# EAGLE design DeskLight (EAGLE 9.4.0)
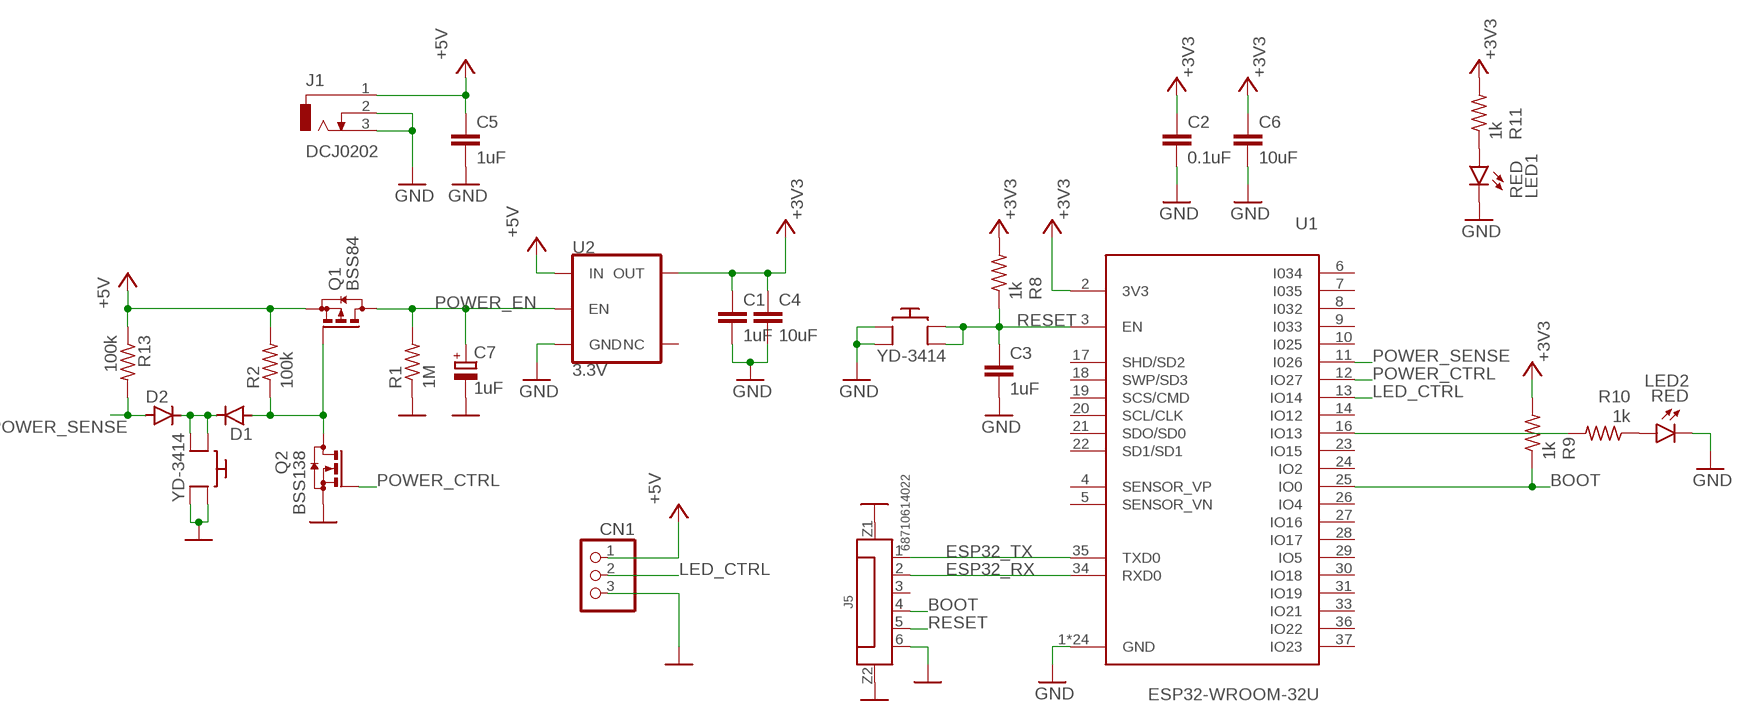
[diagram p0: schematic, sheet 1]

## Parts
C1  1uF  C-EUC0603  [C0603]
C2  0.1uF  C-EUC0603  [C0603]
C3  1uF  C-EUC0603  [C0603]
C4  10uF  C-EUC0805  [C0805]
C5  1uF  C-EUC0603  [C0603]
C6  10uF  C-EUC0805  [C0805]
C7  1uF  CPOL-EUCT3216  [CT3216]
CN1  JST_3PIN  [JSTPH3]
D1  D-SOD123  [SOD123]
D2  D-SOD123  [SOD123]
J1  DCJ0202  [DCJ0202]
J5  68710614022  6871XX14022_68710614022  [68710614022]
LED1  RED  LEDMICRO-SIDELED  [MICRO-SIDELED]
LED2  RED  LEDMICRO-SIDELED  [MICRO-SIDELED]
Q1  BSS84  [SOT23]
Q2  BSS138  BSS123  [SOT23]
R1  1M  R-US_R0603  [R0603]
R2  100k  R-US_R0603  [R0603]
R8  1k  R-US_R0603  [R0603]
R9  1k  R-US_R0603  [R0603]
R10  1k  R-US_R0603  [R0603]
R11  1k  R-US_R0603  [R0603]
R13  100k  R-US_R0603  [R0603]
U1  ESP32-WROOM-32U  [XCVR_ESP32-WROOM-32U]
U2  3.3V  V_REG_AP2112K-3.3V  [SOT23-5]
U$1  YD-3414  [YD-3414]
U$67  YD-3414  [YD-3414]

## Nets
+3V3: C1.1 C2.1 C4.1 C6.1 R8.2 R9.2 R11.2 U1.2(3V3) U2.5(OUT)
+5V: C5.1 CN1.1 J1.1 Q1.2(S) R2.2 R13.1 U2.1(IN)
BOOT: J5.4 R9.1 U1.25(IO0)
ESP32_RX: J5.2 U1.34(RXD0)
ESP32_TX: J5.1 U1.35(TXD0)
GND: C1.2 C2.2 C3.2 C4.2 C5.2 C6.2 C7.- CN1.3 J1.2 J1.3 J5.6 J5.Z1 J5.Z2 LED1.C LED2.C Q2.2(S) R1.1 U1.1(GND) U1.15(GND) U1.38(GND) U1.G.1(GND) U1.G.2(GND) U1.G.4(GND) U1.G.5(GND) U1.G.6(GND) U1.G.7(GND) U1.G.8(GND) U1.G.9(GND) U1.G.10(GND) U1.G.11(GND) U1.G.12(GND) U1.G.13(GND) U1.G.14(GND) U1.G.15(GND) U1.G.16(GND) U1.G.17(GND) U1.G.18(GND) U1.G.19(GND) U1.G.20(GND) U1.G.21(GND) U1.G.22(GND) U2.2(GND) U$1.P$3 U$1.P$4 U$67.P$3 U$67.P$4
LED_CTRL: CN1.2 U1.13(IO14)
N$1: D1.2(A) Q1.1(G) Q2.3(D) R2.1
N$2: R10.2 U1.16(IO13)
N$8: LED1.A R11.1
N$11: D1.1(C) D2.1(C) U$67.P$1 U$67.P$2
N$13: LED2.A R10.1
POWER_CTRL: Q2.1(G) U1.12(IO27)
POWER_EN: C7.+ Q1.3(D) R1.2 U2.3(EN)
POWER_SENSE: D2.2(A) R13.2 U1.11(I026)
RESET: C3.1 J5.5 R8.1 U1.3(EN) U$1.P$1 U$1.P$2
Unconnected: J5.3 U1.4(SENSOR_VP) U1.5(SENSOR_VN) U1.6(I034) U1.7(I035) U1.8(I032) U1.9(I033) U1.10(I025) U1.14(IO12) U1.17(SHD/SD2) U1.18(SWP/SD3) U1.19(SCS/CMD) U1.20(SCL/CLK) U1.21(SDO/SD0) U1.22(SD1/SD1) U1.23(IO15) U1.24(IO2) U1.26(IO4) U1.27(IO16) U1.28(IO17) U1.29(IO5) U1.30(IO18) U1.31(IO19) U1.33(IO21) U1.36(IO22) U1.37(IO23) U2.4(NC)

## Library data of the parts
C1-C6 = rcl:C-EU: CAPACITOR, European symbol; SPICEPREFIX: C
C7 = rcl:CPOL-EU: POLARIZED CAPACITOR, European symbol; SPICEPREFIX: C
CN1 = adafruit:JST_3PIN
D1 D2 = semicon-smd-ipc:D-: DIODE unfilled
J1 = con-jack:DCJ0202: DC POWER JACK Source: DCJ0202.pdf; OC_FARNELL: unknown; OC_NEWARK: unknown
J5 = WR-FPC:6871XX14022_68710614022: WR-FPC 0.50 mm SMT ZIF Horizontal Top Contact KIND PROPERTIES Pitch 0.5 mm MATERIAL PROPERTIES Insulator Material LCP Contact Material Phosphor Bronze Contact Plating 100 (µ") Tin over 50 (µ") Nickel Contact Type Stamped Solder Tabs Brass <https://www.we-online.com/catalog/media/o32866v209%20Family_WE-FPC_6871xx14022.jpg> Details see: https://www.we-online.com/catalog/en/FPC_0_5_SMT_ZIF_HORIZONTAL_TOP_CONTACT_6871XX14022/ Updated by Ella Wu 2020-08-26 2020(C) Wurth Elektronik; CONTACT-RESISTANCE: 20Ohm; DATASHEET-URL: https://www.we-online.com/catalog/datasheet/68710614022.pdf; IR: 0.5A; L: 9.4mm; PACKAGING: Tape and Reel; PART-NUMBER: 68710614022; PINS: 6; PITCH: 0.5mm; TYPE: Horizontal; WORKING-VOLTAGE: 50V(AC)
LED1 LED2 = led:LED: LED OSRAM: - CHIPLED LG R971, LG N971, LY N971, LG Q971, LY Q971, LO R971, LY R971 LH N974, LH R974 LS Q976, LO Q976, LY Q976 LO Q996 - Hyper CHIPLED LW Q18S LB Q993, LB Q99A, LB R99A - SideLED LS A670, LO A670, LY A670, LG A670, LP A670 LB A673, LV A673, LT A673, LW A673 LH A674 LY A675 LS A676, LA A676, LO A676, LY A676, LW A676 LS A679, LY A679, LG A679 - Hyper Micro SIDELED® LS Y876, LA Y876, LO Y876, LY Y876 LT Y87S - SmartLED LW L88C, LW L88S LB L89C, LB L89S, LG L890 LS L89K, LO L89K, LY L89K LS L896, LA L896, LO L896, LY L896 - TOPLED LS T670, LO T670, LY T670, LG T670, LP T670 LSG T670, LSP T670, LSY T670, LOP T670, LYG T670 LG T671, LOG T671, LSG T671 LB T673, LV T673, LT T673, LW T673 LH T674 LS T676, LA T676, LO T676, LY T676, LB T676, LH T676, LSB T676, LW T676 LB T67C, LV T67C, LT T67C, LS T67K, LO T67K, LY T67K, LW E67C LS E67B, LA E67B, LO E67B, LY E67B, LB E67C, LV E67C, LT E67C LW T67C LS T679, LY T679, LG T679 LS T770, LO T770, LY T770, LG T770, LP T770 LB T773, LV T773, LT T773, LW T773 LH T774 LS E675, LA E675, LY E675, LS T675 LS T776, LA T776, LO T776, LY T776, LB T776 LHGB T686 LT T68C, LB T68C - Hyper Mini TOPLED® LB M676 - Mini TOPLED Santana® LG M470 LS M47K, LO M47K, LY M47K Source: http://www.osram.convergy.de LUXEON: - LUMILED® LXK2-PW12-R00, LXK2-PW12-S00, LXK2-PW14-U00, LXK2-PW14-V00 LXK2-PM12-R00, LXK2-PM12-S00, LXK2-PM14-U00 LXK2-PE12-Q00, LXK2-PE12-R00, LXK2-PE12-S00, LXK2-PE14-T00, LXK2-PE14-U00 LXK2-PB12-K00, LXK2-PB12-L00, LXK2-PB12-M00, LXK2-PB14-N00, LXK2-PB14-P00, LXK2-PB14-Q00 LXK2-PR12-L00, LXK2-PR12-M00, LXK2-PR14-Q00, LXK2-PR14-R00 LXK2-PD12-Q00, LXK2-PD12-R00, LXK2-PD12-S00 LXK2-PH12-R00, LXK2-PH12-S00 LXK2-PL12-P00, LXK2-PL12-Q00, LXK2-PL12-R00 Source: www.luxeon.com KINGBRIGHT: KA-3528ASYC Source: www.kingbright.com
Q1 = transistor-small-signal:BSS84: P-CHANNEL MOS FET
Q2 = transistor-small-signal:BSS123: N-CHANNEL MOS FET
R1 R2 R8-R11 R13 = rcl:R-US_: RESISTOR, American symbol; SPICEPREFIX: R
U1 = ESP32-WROOM-32U:ESP32-WROOM-32U: Wi-Fi/BT BLE Module ESP32-D0WD SPI Flash UART U.FL Conn.; AVAILABILITY: Unavailable; DESCRIPTION: Bluetooth, WiFi 802.11b/g/n, Bluetooth v4.2 +EDR, Class 1, 2 and 3 Transceiver Module 2.4GHz ~ 2.5GHz Antenna Not Included, U.FL Surface Mount; MF: Espressif Systems; MP: ESP32-WROOM-32U; PACKAGE: Module Espressif Systems; PRICE: None
U2 = SparkFun-IC-Power:V_REG_AP2112: AP2112 - 600mA CMOS LDO Regulator w/ Enable The AP2112 is CMOS process low dropout linear regulator with enable function, the regulator delivers a guaranteed 600mA (min.) continuous load current. Features Output Voltage Accuracy: ±1.5% Output Current: 600mA (Min.) Foldback Short Current Protection: 50mA Enable Function to Turn ON/OFF VOUT Low Dropout Voltage (3.3V): 250mV (Typ.) @IOUT=600mA Excellent Load Regulation: 0.2%/A (Typ.) Excellent Line Regulation: 0.02%/V (Typ.) Low Quiescent Current: 55μA (Typ.) Low Standby Current: 0.01μA (Typ.) Low Output Noise: 50μVRMS PSRR: 100Hz -65dB, 1kHz -65dB OTSD Protection Stable with 1.0μF Flexible Cap: Ceramic, Tantalum and Aluminum Electrolytic Operation Temperature Range: -40°C to 85°C ESD: MM 400V, HBM 4000V; PROD_ID: VREG-12457
U$1 U$67 = YD-3414:YD-3414

## Board
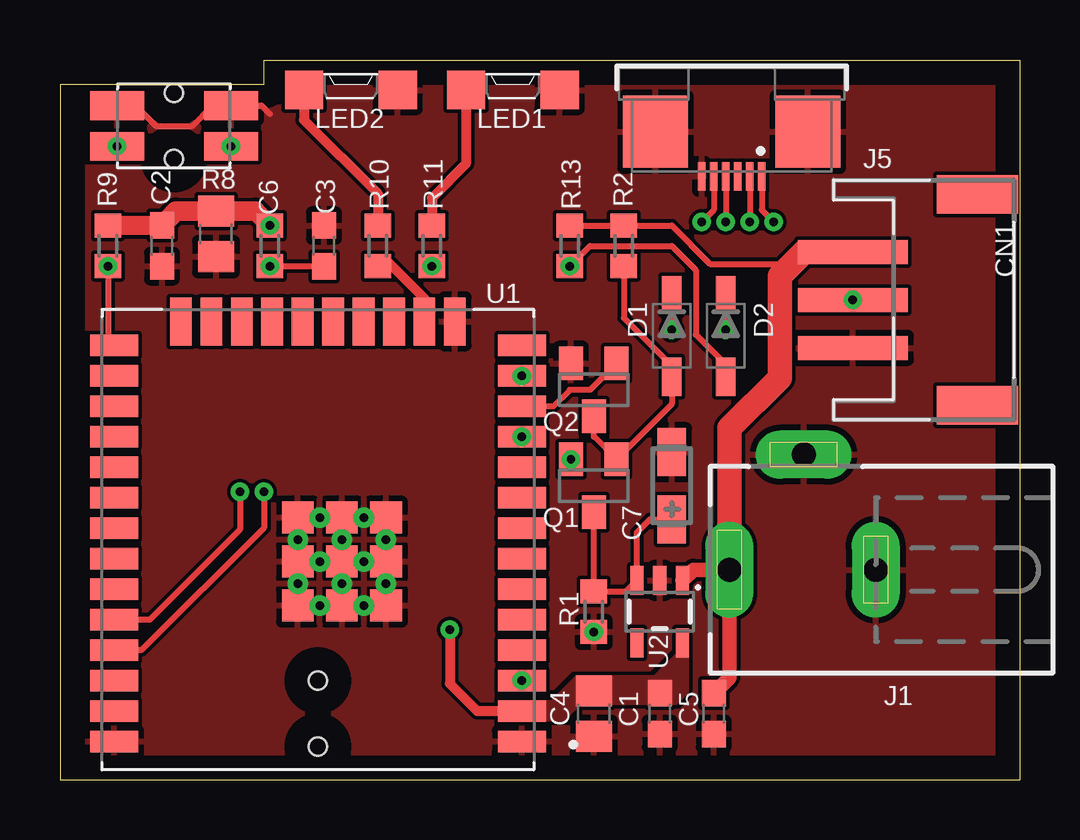
[diagram p1: board, top side]
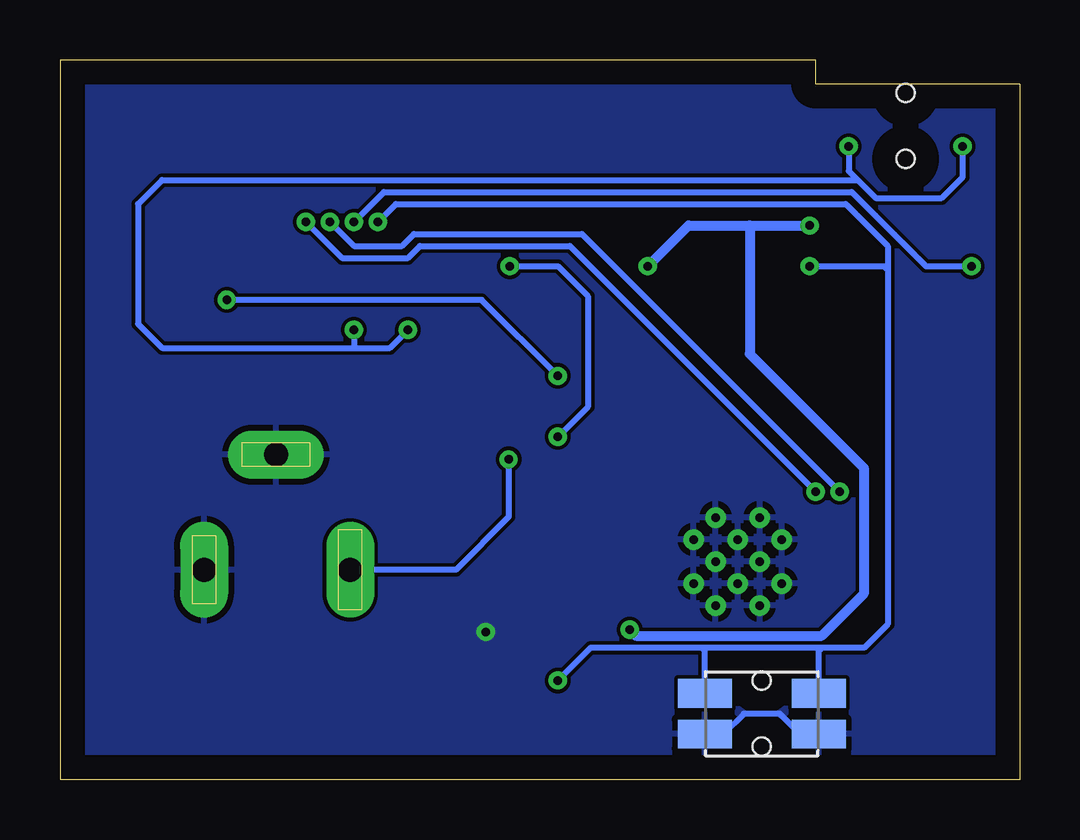
[diagram p2: board, bottom side, seen from below]

Size 40 x 30 mm. Coordinates in mm from the lower left corner, seen from the top.
Outline: 0,29 0,0 40,0 40,30 8.5,30 8.5,29 0,29
Copper layers (1*16): Top 0.035mm / dielectric 0.93mm / Bottom 0.035mm
Design rules "default *": minimum track width 6mil, minimum drill 0.35mm, track to track 6mil, track to pad 6mil, pad to pad 6mil, via to via 6mil, smd to smd 6mil, copper to edge 40mil, drill to drill 6mil, minimum pad ring 10mil, minimum via ring 8mil, stop-mask expansion 4mil, vias tented up to drill 0.35mm, thermal gap 10mil

### Footprints (pad centres in the part's own frame; a part is rotated, then mirrored left to right if it is on the bottom)
C0603 = smd 1.1 x 1: 1 -0.85,0; 2 0.85,0
C0805 = smd 1.3 x 1.5: 1 -0.95,0; 2 0.95,0
CT3216 = smd 2 x 1.2: + -1.4,0; - 1.4,0
JSTPH3 = smd 1 x 4.6: 1 -2,-2.7; 2 0,-2.7; 3 2,-2.7 | smd 1.6 x 3.4: NC1 -4.4,2.5; NC2 4.4,2.5
SOD123 = smd 1.6 x 0.8: 1 -1.7,0; 2 1.7,0
DCJ0202 = drill 1 pad 2 long: 1 0,3.1; 2 4.8,0; 3 0,-3
68710614022 = smd 0.3 x 1.2: 1 -1.25,2.35; 2 -0.75,2.35; 3 -0.25,2.35; 4 0.25,2.35; 5 0.75,2.35; 6 1.25,2.35 | smd 2.7 x 3: Z1 -3.18,0.49; Z2 3.18,0.49
MICRO-SIDELED = smd 1.6 x 1.6: A 0,1.95; C 0,-1.95
SOT23 = smd 1 x 1.4: 1 -0.95,-1.1; 2 0.95,-1.1; 3 0,1.1
R0603 = smd 1 x 1.1: 1 -0.85,0; 2 0.85,0
XCVR_ESP32-WROOM-32U = smd 2 x 0.9: 1 -8.5,8.41; 2 -8.5,7.14; 3 -8.5,5.87; 4 -8.5,4.6; 5 -8.5,3.33; 6 -8.5,2.06; 7 -8.5,0.79; 8 -8.5,-0.48; 9 -8.5,-1.75; 10 -8.5,-3.02; 11 -8.5,-4.29; 12 -8.5,-5.56; 13 -8.5,-6.83; 14 -8.5,-8.1; 25 8.5,-8.1; 26 8.5,-6.83; 27 8.5,-5.56; 28 8.5,-4.29; 29 8.5,-3.02; 30 8.5,-1.75; 31 8.5,-0.48; 32 8.5,0.79; 33 8.5,2.06; 34 8.5,3.33; 35 8.5,4.6; 36 8.5,5.87; 37 8.5,7.14; 38 8.5,8.41 | smd 0.9 x 2: 15 -5.715,-9.1; 16 -4.445,-9.1; 17 -3.175,-9.1; 18 -1.905,-9.1; 19 -0.635,-9.1; 20 0.635,-9.1; 21 1.905,-9.1; 22 3.175,-9.1; 23 4.445,-9.1; 24 5.715,-9.1 | smd 1.33 x 1.33: G.1 0.835,2.745; G.2 -1,2.745; G.4 -2.835,2.745; G.5 0.835,0.91; G.6 -1,0.91; G.7 -2.835,0.91; G.8 0.835,-0.925; G.9 -1,-0.925; G.10 -2.835,-0.925 | drill 0.35: G.11 -0.083,2.745; G.12 -1.917,2.745; G.13 0.835,1.827; G.14 -1,1.827; G.15 -2.835,1.827; G.16 -0.083,0.91; G.17 -1.917,0.91; G.18 0.835,-0.007; G.19 -1,-0.007; G.20 -2.835,-0.007; G.21 -0.083,-0.925; G.22 -1.917,-0.925
SOT23-5 = smd 0.55 x 1.2: 1 -0.95,-1.3; 2 0,-1.3; 3 0.95,-1.3; 4 0.95,1.3; 5 -0.95,1.3
YD-3414 = smd 2.25 x 1.2: P$1 -2.375,0.85; P$2 2.375,0.85; P$3 -2.375,-0.85; P$4 2.375,-0.85 | hole 0.75: 0,-1.375; 0,1.375

### Placement (x,y rotation side)
C1  25,2.75 270 top
C2  4.25,22.25 270 top
C3  11,22.25 90 top
C4  22.25,2.75 270 top
C5  27.25,2.75 270 top
C6  6.5,22.75 270 top
C7  25.5,12.25 90 top
CN1  35.75,20 270 top
D1  25.5,18.5 270 top
D2  27.75,18.5 270 top
J1  31,8.75 90 top
J5  28,27.5 180 top
LED1  18.88,28.75 90 top
LED2  12.12,28.75 90 top
Q1  22.25,12.25 180 top
Q2  22.25,16.25 180 top
R1  22.25,7 90 top
R2  23.5,22.25 90 top
R8  8.75,22.25 90 top
R9  2,22.25 90 top
R10  13.25,22.25 270 top
R11  15.5,22.25 270 top
R13  21.25,22.25 270 top
U1  10.75,10 180 top
U2  25,7 180 top
U$1  10.75,2.75 0 bottom
U$67  4.75,27.25 180 top

### Tracks (layer width: path | path; a pad name or v marks a point on that pad's centre or on a via)
+3V3  (via drill 0.35)
  Top 0.406: v16.25,6.25 16.25,4 17.39,2.86 U1.2
  Top 0.813: R9.2 2.02,23.12 C2.1 4.83,23.7 C6.1 8.15,23.7 R8.2
  Bottom 0.406: R11.2 13.8,23.1 11.25,23.1 | 11.25,23.1 R8.2 | 11.25,23.1 11.25,17.75 6.5,13 6.5,7.75 8.25,6 16,6 v16.25,6.25
  other vias: 15.5,21.4 8.75,23.1
  pour Top (no thermals): 18.33,3.23 20.48,3.23 21.52,4.27 24.77,4.27 25.75,5.25 25.75,6.22 26.15,6.22 26.15,3.65 25.67,3.17 21.67,3.17 20.98,2.48 18.33,2.48
+5V  (via drill 0.35)
  Top 0.254: R13.1 R2.2 25.5,23.1 27.1,21.5 30.5,21.5
  Top 0.61: U2.1 26.4,8.75 J1.1 27.9,4.25 C5.1
  Top 1.016: J1.1 27.9,14.65 30,16.75 30,21 30.5,21.5 31,22 CN1.1
  Bottom 0.254: Q1.2 21.3,10.95 23.5,8.75 J1.1
  other vias: 21.3,13.35
BOOT  (via drill 0.35)
  Top 0.254: R9.1 2,18.35 U1.25 | J5.4 v27.75,23.25
  Bottom 0.254: v27.75,23.25 26.5,24.5 7,24.5 3.9,21.4 R9.1
  other vias: 2,21.4
ESP32_RX  (via drill 0.35)
  Top 0.254: J5.2 v28.75,23.25 | v7.5,12 7.5,10.42 3.75,6.67 U1.34
  Bottom 0.254: v28.75,23.25 27.75,22.25 25.75,22.25 25.25,22.75 18.25,22.75 v7.5,12
ESP32_TX  (via drill 0.35)
  Top 0.254: J5.1 29.25,23.75 v29.75,23.25 | U1.35 3.4,5.4 8.5,10.5 v8.5,12
  Bottom 0.254: v29.75,23.25 28.25,21.75 25.5,21.75 25,22.25 18.75,22.25 v8.5,12
GND  (via drill 0.35)
  Top 0.254: U$67.P$4 3.15,28.1 4,27.25 5.5,27.25 6.35,28.1 U$67.P$3 8.4,28.1 8.75,27.75
  Bottom 0.254: U$1.P$4 9.15,1.9 10,2.75 11.5,2.75 12.35,1.9 U$1.P$3
  other vias: 22.25,6.15
  pour Bottom (rank 2): 0,0 0,30 40,30 40,0
  pour Top (rank 2): 0,0 0,30 40,30 40,0
LED_CTRL  (via drill 0.35)
  Bottom 0.254: U1.13 22.42,20 CN1.2
  other vias: 19.25,16.83 33.05,20
N$1
  Top 0.254: Q2.3 22.25,14.3 Q1.1 25.5,15.65 D1.2 25.5,17.25 23.5,19.25 R2.1
N$2
  Top 0.406: U1.16 15.2,20.05 13.75,21.5 13.35,21.5 R10.2
N$8
  Top 0.406: LED1.A 16.93,25.68 15.5,24.25 R11.1
N$11  (via drill 0.35)
  Top 0.254: v25.5,18.75 D1.1 | D2.1 v27.75,18.75
  Bottom 0.254: 27.75,18 35.75,18 36.75,19 36.75,24 35.75,25 6.75,25 | 27.75,18 26.25,18 v25.5,18.75 | v27.75,18.75 27.75,18 | 6.75,25 6,24.25 3.25,24.25 2.38,25.12 U$67.P$2 | U$67.P$1 7.12,25.38 6.75,25
  other vias: 2.38,26.4 7.12,26.4
N$13
  Top 0.406: LED2.A 10.18,27.5 13.25,24.43 R10.1
POWER_CTRL
  Top 0.254: Q2.1 22.1,16.25 21.25,16.25 20.56,15.56 U1.12
POWER_EN
  Top 0.254: Q1.3 R1.2 23.6,7.85 U2.3 24.05,10.3 24.6,10.85 C7.+
POWER_SENSE  (via drill 0.35)
  Top 0.254: R13.2 22.1,22.25 25.5,22.25 26.5,21.25 26.5,18.55 27.75,17.3 D2.2
  Bottom 0.254: R13.2 19.25,21.4 18,20.15 18,15.54 U1.11
  other vias: 21.25,21.4 19.25,14.29
RESET  (via drill 0.35)
  Top 0.254: R8.1 10.97,21.4 C3.1 | J5.5 27.25,23.75 v26.75,23.25
  Bottom 0.254: v26.75,23.25 26,24 7.25,24 5.5,22.25 5.5,21.25 | 5.5,21.25 5.5,6.47 6.47,5.5 8.25,5.5 | 5.5,21.25 5.65,21.4 R8.1 | U1.3 17.88,5.5 13.25,5.5 | 8.25,5.5 13.25,5.5 | U$1.P$1 13.12,5.38 13.25,5.5 | U$1.P$2 8.38,5.38 8.25,5.5
  other vias: 19.25,4.13 8.75,21.4